# Altium schematic sheet RTC-EEPROM.SchDoc: RTC / EEPROM
size A3; Date: 16.10.2015; DocumentNumber: 4; Revision: 11; SheetNumber: 4; SheetTotal: 5
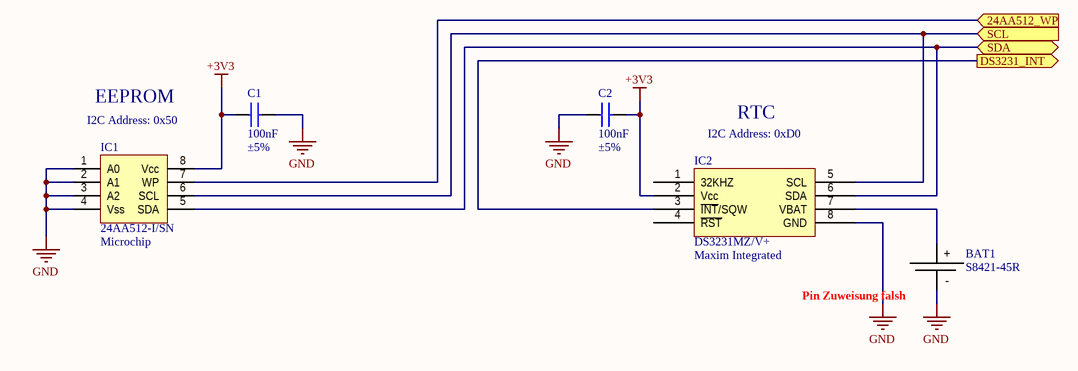
[diagram p0: RTC-EEPROM.SchDoc]

## Parts
BAT1  S8421-45R  [S8421-45R]
C1  Kapazität: 100nF  Toleranz: ±5%  [C0603]  (hidden comment: C0603C104J4RACTU)
C2  Kapazität: 100nF  Toleranz: ±5%  [C0603]  (hidden comment: C0603C104J4RACTU)
IC1  24AA512-I/SN  Manufacturer: Microchip  [SOIC-8]
IC2  DS3231MZ/V+  Manufacturer: Maxim Integrated  [SOIC-8]

## Ports
24AA512_WP (in), DS3231_INT (out), SCL (in), SDA (bidir)

## Nets
+3V3: C1.1 C2.2 IC1.8(Vcc) IC2.2(Vcc)
GND: BAT1.2 C1.2 C2.1 IC1.1(A0) IC1.2(A1) IC1.3(A2) IC1.4(Vss) IC2.8(GND)
24AA512_WP: IC1.7(WP) ; port 24AA512_WP
DS3231_INT: IC2.3(~{INT}/SQW) ; port DS3231_INT
SCL: IC1.6(SCL) IC2.5(SCL) ; port SCL
SDA: IC1.5(SDA) IC2.6(SDA) ; port SDA
NetBAT1_1: BAT1.1 IC2.7(VBAT)

Not connected (* = marked no-connect by the designer): IC2 1(32KHZ) 4(~{RST})

## Notes on the sheet
- I2C Address: 0x50
- EEPROM
- RTC
- (near IC2) I2C Address: 0xD0
- Pin Zuweisung falsh
- INFORMATION
- CLASSIFICATION
- PROJECT
- COMPONENT
- SEKAI Europe GmbH
- TITLE
- The information contained in this schematic is the property of SEKAI Europe. Any usage in part or as whole without the written permission of SEKAI Europe is strictly prohibited.
- DRAWN BY
- CREATED
- MODIFIED
- VER.#
- SCHEM.#
- REV
- SHEET
- A3
- Printed:
- (in symbol S8421-45R) +; -

## Library data of the parts
BAT1 = S8421-45R: HOLDER BATT COIN CR2032/20MM; Manufacturer: Harwin Inc.; Battery Type, Function: Coin Cell, Holder; Style: Holder (Open); Battery Cell Size: Coin, 20.0mm; Number of Cells: 1; Battery Series: 2032; Supplier 1: Digi-Key; Manufacturer Part Number: S8421-45R; RoHS: RoHS Compliant; Category: Battery Products; Stock 1: 11432; Pricing 1: 1=0.95, 10=0.855, 50=0.76, 100=0.665, 250=0.608 (EUR); Mounting Type: PCB, Surface Mount; Termination Style: SMD (SMT) Tab; Height Above Board: 0.185" (4.70mm); Operating Temperature: -40°C ~ 105°C; ComponentLink1URL: http://cdn.harwin.com/pdfs/S8421R.pdf; ComponentLink1Description: http://cdn.harwin.com/pdfs/S8421R.pdf; Supplier Part Number 1: 952-1737-1-ND
C1 C2 = C0603C104J4RACTU: CAP CER 100NF 16V 5% X7R 0603; Manufacturer: Kemet; Verpackung: Am Band (Cut Tape - CT); Montagetyp: Oberflächenmontage, MLCC; Betriebstemperatur: -55°C bis 125°C; Anwendungen: Mehrzweckanwendungen; Gehäuse / Hülle: 0603 (1608 Metrisch); Dicke (max.): 0,034" (0,87 mm); Supplier 1: Digi-Key; Manufacturer Part Number: C0603C104J4RACTU; RoHS: RoHS Compliant; Category: Kondensatoren; Stock 1: 557573; Pricing 1: 1=0.11, 10=0.079, 25=0.0584, 50=0.045, 100=0.0372, 250=0.03132, 1000=0.02112 (EUR); Spannung - Nennwert: 16V; Temperaturwirkungsgrad: X7R; Nenngrößen: -; Grösse / Dimension: L x B: 0,063" x 0,031" (1,60 mm x 0,80 mm); Höhe - eingesteckt (max.): -; Rastermaß: -; Funktionen: -; Leitungstyp: -; ComponentLink1URL: http://www.kemet.com/docfinder?Partnumber=C0603C104J4RACTU; ComponentLink1Description: http://www.kemet.com/docfinder?Partnumber=C0603C104J4RACTU; Supplier Part Number 1: 399-1097-1-ND
IC1 = 24AA512-I/SN: IC EEPROM 512KBIT 400KHZ 8SOIC; Format - Memory: EEPROMs - Serial; Memory Size: 512K (64K x 8); Speed: 100kHz, 400kHz; Interface: I²C, 2-Wire Serial; Voltage - Supply: 1.7 V ~ 5.5 V; Supplier 1: Digi-Key; Manufacturer Part Number: 24AA512-I/SN; RoHS: RoHS Compliant; Category: Integrated Circuits (ICs); Stock 1: 7846; Pricing 1: 1=1.37, 10=1.142, 25=1.0972, 100=1.0816 (EUR); Packaging: Tube; Memory Type: EEPROM; Operating Temperature: -40°C ~ 85°C; Package / Case: 8-SOIC (0.154", 3.90mm Width); Supplier Device Package: 8-SOIC N; ComponentLink1URL: http://www.microchip.com/mymicrochip/filehandler.aspx?ddocname=en546203; ComponentLink1Description: http://www.microchip.com/mymicrochip/filehandler.aspx?ddocname=en546203; Supplier Part Number 1: 24AA512-I/SN-ND
IC2 = DS3231MZ/V+: IC RTC CLK/CALENDAR I2C 8-SOIC; Time Format: HH:MM:SS (12/24 hr); Date Format: YY-MM-DD-dd; Interface: I²C, 2-Wire Serial; Voltage - Supply: 2.3 V ~ 5.5 V; Current - Timekeeping (Max): 130µA ~ 200µA @ 3.63V ~ 5.5V; Supplier 1: Digi-Key; Manufacturer Part Number: DS3231MZ/V+; RoHS: RoHS Compliant; Category: Integrated Circuits (ICs); Stock 1: 568; Pricing 1: 1=5.88, 10=5.584, 25=4.6036, 50=4.3736, 250=4.23532, 1000=3.61934 (EUR); Packaging: Tube; Type: Clock/Calendar; Features: Alarm, Leap Year, Square Wave Output; Memory Size: -; Voltage - Supply, Battery: 2.3 V ~ 5.5 V; Operating Temperature: -40°C ~ 85°C; Mounting Type: Surface Mount; Package / Case: 8-SOIC (0.154", 3.90mm Width); Supplier Device Package: 8-SOIC N; ComponentLink1URL: http://datasheets.maximintegrated.com/en/ds/DS3231M.pdf; ComponentLink1Description: http://datasheets.maximintegrated.com/en/ds/DS3231M.pdf; Supplier Part Number 1: DS3231MZ/V+-ND